# Altium schematic sheet Phase Current Voltage Sense.SchDoc
size A4
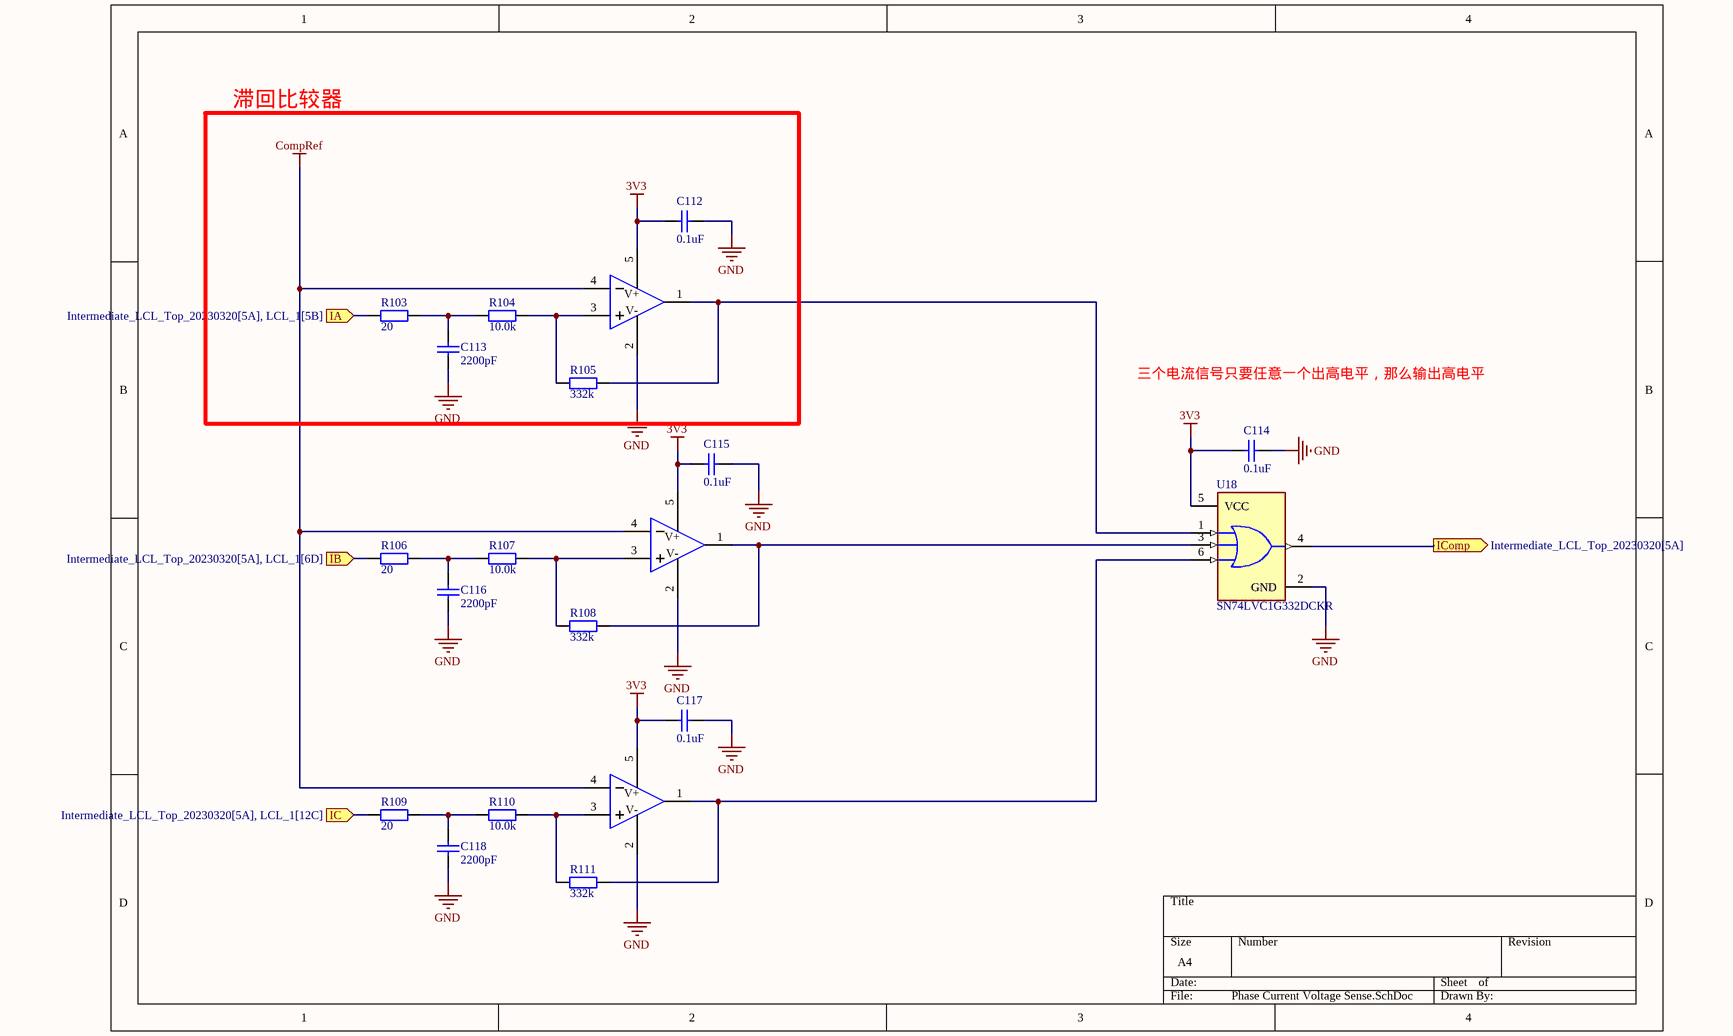
[diagram p0: Phase Current Voltage Sense.SchDoc]

## Parts
C112  0.1uF  [CAPC1608X06N]
C113  2200pF  [CAPC1608X06N]
C114  0.1uF  [CAPC1608X06N]
C115  0.1uF  [CAPC1608X06N]
C116  2200pF  [CAPC1608X06N]
C117  0.1uF  [CAPC1608X06N]
C118  2200pF  [CAPC1608X06N]
R103  20  [RESC1608X05N]
R104  10.0k  [RESC1608X05N]
R105  332k  [RESC1608X05N]
R106  20  [RESC1608X05N]
R107  10.0k  [RESC1608X05N]
R108  332k  [RESC1608X05N]
R109  20  [RESC1608X05N]
R110  10.0k  [RESC1608X05N]
R111  332k  [RESC1608X05N]
U17  TLV3201AIDBVR  [SOT-23-5_L3.0-W1.7-P0.95-LS2.8-BR]  (value not drawn)
U18  SN74LVC1G332DCKR  [FP-DCK0006A-MFG]
U19  TLV3201AIDBVR  [SOT-23-5_L3.0-W1.7-P0.95-LS2.8-BR]  (value not drawn)
U20  TLV3201AIDBVR  [SOT-23-5_L3.0-W1.7-P0.95-LS2.8-BR]  (value not drawn)

## Ports
IA (in, see Intermediate_LCL_Top_20230320[5A], LCL_1[5B]), IB (in, see Intermediate_LCL_Top_20230320[5A], LCL_1[6D]), IC (in, see Intermediate_LCL_Top_20230320[5A], LCL_1[12C]), IComp (out, see Intermediate_LCL_Top_20230320[5A])

## Nets
3V3: C112.1 C114.1 C115.1 C117.1 U17.5(VCC) U18.5(VCC) U19.5(VCC) U20.5(VCC)
CompRef: U17.4(IN-) U19.4(IN-) U20.4(IN-)
GND: C112.2 C113.2 C114.2 C115.2 C116.2 C117.2 C118.2 U17.2(GND) U18.2(GND) U19.2(GND) U20.2(GND)
IA: R103.2 ; port IA
IB: R106.2 ; port IB
IC: R109.2 ; port IC
IComp: U18.4(Y) ; port IComp
NetC113_1: C113.1 R103.1 R104.2
NetC116_1: C116.1 R106.1 R107.2
NetC118_1: C118.1 R109.1 R110.2
NetR104_1: R104.1 R105.2 U17.3(IN+)
NetR105_1: R105.1 U17.1(OUT) U18.1(A)
NetR107_1: R107.1 R108.2 U19.3(IN+)
NetR108_1: R108.1 U18.3(B) U19.1(OUT)
NetR110_1: R110.1 R111.2 U20.3(IN+)
NetR111_1: R111.1 U18.6(C) U20.1(OUT)

## Notes on the sheet
- 滞回比较器
- 三个电流信号只要任意一个出高电平，那么输出高电平
- (in symbol TLV3201AIDBVR) V+; V-

## Library data of the parts
C112-C118 = Cap: Capacitor; Published: 8-Jun-2000; LatestRevisionDate: 17-Jul-2002; LatestRevisionNote: Re-released for DXP Platform.; PackageReference: RAD-0.3; Publisher: Altium Limited; PackageDescription: Radial Cap, Thru-Hole; 2 Leads; 0.3 in Pin Spacing
  C112 C114 C115 C117: Value: 0.1uF
  C113 C116 C118: Value: 2200pF
R103-R111 = 0603 100KΩ (1003) 1%_4: 贴片电阻; Value: 1MΩ(1%); ComponentLink1Description: 供应商链接; ComponentLink1URL: http://www.szlcsc.com/product/details_26546.html; Package: 0603; Supplier: LC; SuppliersPartNumber: C25803
U17 U19 U20 = TLV3201AIDBVR: Manufacturer: TI(德州仪器); Add into BOM: yes; Input Offset Voltage (Vos): 1mV; Input Bias Current (Ib): 5nA; Propagation Delay Time: 40ns; Input Hysteresis Voltage (Vhys): 1.2mV; Common Mode Rejection Ratio (CMRR): 70dB; Supply Voltage: 2.7V~5.5V; Output Type: 推挽; Supply Current: 40uA; Symbol: TLV3201AIDBVR; Device: TLV3201AIDBVR; LCSC Part Name: TLV3201AIDBVR; Supplier Part: C105188; Manufacturer Part: TLV3201AIDBVR; Supplier Footprint: SOT-23-5; JLCPCB Part Class: Extended Part; Datasheet: https://www.ti.com/cn/lit/gpn/tlv3201; Supplier: LCSC; Convert to PCB: yes; Output Mode: -; Rail-to-Rail: -; Operating Temperature: -40℃~+125℃
U18 = CMP-0859-00464-4: IC GATE OR 1CH 3-INP SC70-6; Manufacturer: Texas Instruments; Min Supply Voltage: 1.65V; Number Of Circuits: 1; Nominal Supply Current: 10uA; Number Of Inputs: 3; Max Supply Voltage: 5.5V; Propagation Delay: 20ns; Standoff Height: 0mm; Logic Function Desc: Non-Inverting; Manufacturer Part Number: SN74LVC1G332DCKR; Automotive: No; Temperature: -40°C to +125°C; Device Class L1: Integrated Circuits (ICs); ComponentLink2URL: http://www.ti.com/lit/ds/symlink/sn74lvc1g332.pdf; RoHS: TRUE; Digikey Description: IC GATE OR 1CH 3-INP SC70-6; Octopart: https://octopart.com/sn74lvc1g332dckr-texas+instruments-464861; Ambient Temperature Range Low: -40°C; Number Of Outputs: 1; Height: 1.1mm; Device Class L2: Logic ICs; Mouser Description: Logic Gates Single 3-Input Pos- OR Gate; ComponentLink2Description: Datasheet; Package: DCK0006A; Temperature Range Low: -40°C; Ambient Temperature Range High: +125°C; Temperature Range High: +125°C; Category: IC; Device Class L3: Logic Gates; Lead Free: Yes